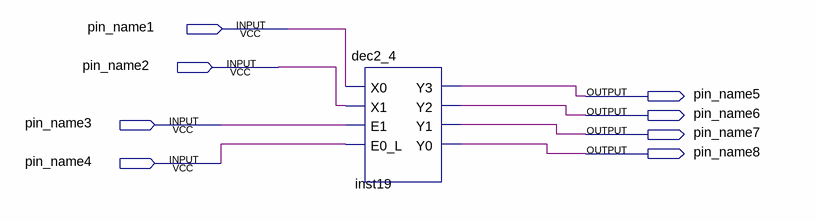
[diagram p0: schematic sheet]
// Quartus schematic DecoderDemo.bdf as structural Verilog: 1 symbols, 8 pins
module DecoderDemo (
  input  pin_name1,
  input  pin_name2,
  input  pin_name3,
  input  pin_name4,
  output pin_name5,
  output pin_name6,
  output pin_name7,
  output pin_name8
);

  dec2_4 inst19 (
    .X0(pin_name1), .X1(pin_name2), .E1(pin_name3), .E0_L(pin_name4), .Y3(pin_name5), .Y2(pin_name6),
    .Y1(pin_name7), .Y0(pin_name8));
endmodule
